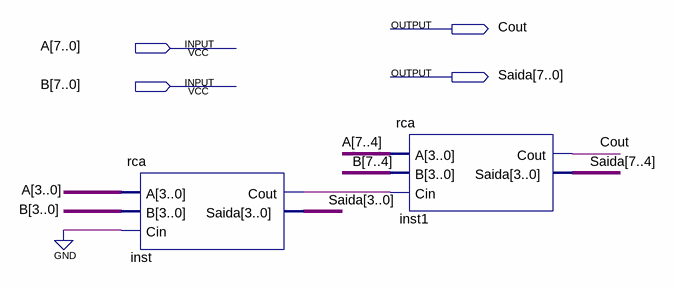
[diagram p0: schematic sheet]
// Quartus schematic rca8.bdf as structural Verilog: 2 symbols, 4 pins
module rca8 (
  input  [7:0] A,
  input  [7:0] B,
  output Cout,
  output [7:0] Saida
);

  wire inst_cout;

  rca inst (.A(A[3:0]), .B(B[3:0]), .Cin(1'b0), .Cout(inst_cout), .Saida(Saida[3:0]));
  rca inst1 (.A(A[7:4]), .B(B[7:4]), .Cin(inst_cout), .Cout(Cout), .Saida(Saida[7:4]));
endmodule
